# Altium schematic sheet SeccionRF.SchDoc
size A4
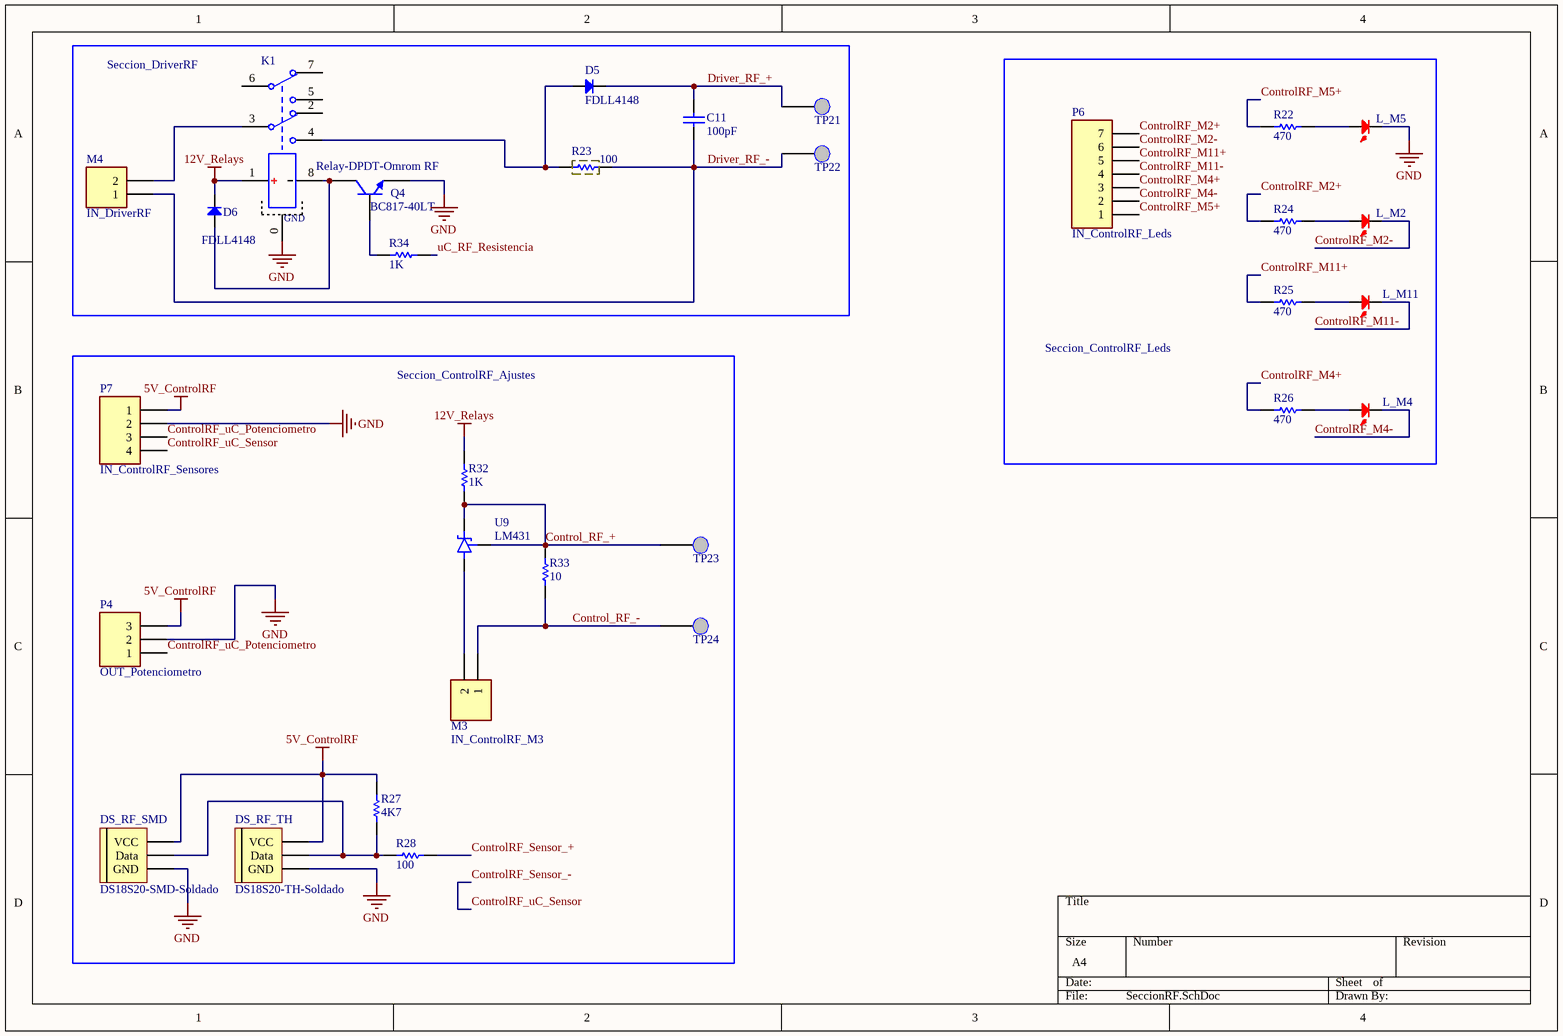
[diagram p0: SeccionRF.SchDoc]

## Parts
C11  100pF  [C_0805]
D5  FDLL4148  [SOD-80/MLL34]
D6  FDLL4148  [SOD-80/MLL34]
DS_RF_SMD  DS18S20-SMD-Soldado  [SOIC8]
DS_RF_TH  DS18S20-TH-Soldado  [TO92]
K1  Relay-DPDT-Omrom RF  [Relay RF omron]
L_M2  PinesParaLed  [Jumper-Simple]  (value not drawn)
L_M4  PinesParaLed  [Jumper-Simple]  (value not drawn)
L_M5  PinesParaLed  [Jumper-Simple]  (value not drawn)
L_M11  PinesParaLed  [Jumper-Simple]  (value not drawn)
M3  IN_ControlRF_M3  [B2B-XH-A_3D]
M4  IN_DriverRF  [B2B-XH-A_3D]
P4  OUT_Potenciometro  [B3B-XH-A_3D]
P6  IN_ControlRF_Leds  [B7B-XH-A_3D]
P7  IN_ControlRF_Sensores  [B4B-XH-A_3D]
Q4  BC817-40LT  [SOT23]
R22  470  [R_0805]
R23  100  [R 10W]
R24  470  [R_0805]
R25  470  [R_0805]
R26  470  [R_0805]
R27  4K7  [R_0805]
R28  100  [R_0805]
R32  1K  [R_0805]
R33  10  [R_0805]
R34  1K  [R_0805]
TP21  DRF+  [TP-5002]  (value not drawn)
TP22  DRF-  [TP-5002]  (value not drawn)
TP23  CRF+  [TP-5002]  (value not drawn)
TP24  CRF-  [TP-5002]  (value not drawn)
U9  LM431  [SOT89]

## Blocks framed on the sheet
Seccion_DriverRF: C11 D5 D6 K1 M4 Q4 R23 R34 TP21 TP22
Seccion_ControlRF_Leds: L_M2 L_M4 L_M5 L_M11 P6 R22 R24-R26
Seccion_ControlRF_Ajustes: DS_RF_SMD DS_RF_TH M3 P4 P7 R27 R28 R32 R33 TP23 TP24 U9

## Nets
5V_ControlRF: DS_RF_SMD.3(VCC) DS_RF_TH.3(VCC) P4.3 P7.1 R27.2
12V_Relays: D6.2(K) K1.1(+) R32.2
GND: DS_RF_SMD.5(GND) DS_RF_TH.1(GND) K1.0(GND) L_M5.2 P4.2 P7.2 Q4.2(E)
Control_RF_+: R32.1 R33.2 TP23.1 U9.1(R) U9.3(K)
Control_RF_-: M3.1 R33.1 TP24.1
ControlRF_M2+: P6.7 R24.1
ControlRF_M2-: L_M2.2 P6.6
ControlRF_M4+: P6.3 R26.1
ControlRF_M4-: L_M4.2 P6.2
ControlRF_M5+: P6.1 R22.1
ControlRF_M11+: P6.5 R25.1
ControlRF_M11-: L_M11.2 P6.4
ControlRF_Sensor_+: R28.2
ControlRF_Sensor_-: P7.4  [also labelled ControlRF_uC_Sensor]
ControlRF_uC_Potenciometro: P4.1 P7.3
Driver_RF_+: C11.2 D5.2(K) TP21.1
Driver_RF_-: C11.1 M4.1 R23.2 TP22.1
uC_RF_Resistencia: R34.1
NetD5_1: D5.1(A) K1.4(NOa) R23.1
NetD6_1: D6.1(A) K1.8(-) Q4.3(C)
NetDS_RF_SMD_4: DS_RF_SMD.4(Data) DS_RF_TH.2(Data) R27.1 R28.1
NetK1_3: K1.3(Ca) M4.2
NetL_M2_1: L_M2.1 R24.2
NetL_M4_1: L_M4.1 R26.2
NetL_M5_1: L_M5.1 R22.2
NetL_M11_1: L_M11.1 R25.2
NetM3_2: M3.2 U9.2(A)
NetQ4_1: Q4.1(B) R34.2

Not connected (* = marked no-connect by the designer): K1 2(NCa) 5(NOb) 6(Cb) 7(NCb)

## Library data of the parts
C11 = C_100pF: CAP CER 100PF 50V C0G/NP0 0805; Note: Footprint corresponds to dimensions for bulk cassette packaging. This case size has tightened tolerances.; Cod.Fabricante: C0805C101J5GACTU; Fabricante: KEMET; Published: 17-Jul-2002; LatestRevisionDate: 19-Mar-2004; LatestRevisionNote: Silkscreen size reduced.; DatasheetDocument: Mar-2001; PackageDocument: Mar-2001; PackageReference: 0805; Publisher: Altium Limited; ComponentLink1Description: Manufacturer Link; ComponentLink1URL: http://www.kemet.com/; ComponentLink2Description: Datasheet; Cod.Digikey: 399-1122-1-ND; Value: 100pF; DIGIKEYx100: 0.02980
D5 D6 = Diode FDLL4148: DIODE GEN PURP 100V 200MA LL34/SOD80/MINI MELF; Fabricante: ON Semiconductor; Published: 8-Jun-2000; LatestRevisionDate: 17-Jul-2002; LatestRevisionNote: Re-released for DXP Platform.; DatasheetDocument: 1998; PackageDocument: Aug-1999; PackageReference: MINI MELF; Publisher: Altium Limited; Code_JEDEC: MINI MELF; ComponentLink1Description: Manufacturer Link; ComponentLink1URL: https://www.fairchildsemi.com; ComponentLink2Description: Datasheet; ComponentLink2URL: https://www.fairchildsemi.com/datasheets/FD/FDLL4148.pdf; Value: FDLL4148; Cod.Digikey: FDLL4148CT-ND; Cod.Fabricante: FDLL4148; DIGIKEYx100: 0.0487
DS_RF_SMD = DS18S20-SMD-Soldado: SENSOR DIGITAL -55C-125C 8SOIC; Cod.Fabricante: DS18S20Z+; Fabricante: Maxim Integrated; Cod.DigiKey: DS18S20Z+-ND; ComponentLink1Description: Manufacturer Link; ComponentLink1URL: https://datasheets.maximintegrated.com/en/ds/DS18S20.pdf; ComponentLink2Description: Datasheet; ComponentLink2URL: *; DatasheetVersion: *; DIGIKEYx10: 3.62160; LatestRevisionDate: *; LatestRevisionNote: *; PackageDescription: *; PackageReference: 8-SOIC; PackageVersion: *; Published: 29-sep-00; Publisher: Altium Limited; Value: DS18S20
DS_RF_TH = DS18S20-TH-Soldado: Temperature Sensor Digital, Local -55°C ~ 125°C 8 b TO-92-3; Cod.Fabricante: DS18S20+; Fabricante: Maxim Integrated; Cod.DigiKey: DS18S20+-ND; ComponentLink1Description: Manufacturer Link; ComponentLink1URL: https://datasheets.maximintegrated.com/en/ds/DS18S20.pdf; ComponentLink2Description: Datasheet; ComponentLink2URL: *; DatasheetVersion: *; DIGIKEYx10: 2.96300; LatestRevisionDate: *; LatestRevisionNote: *; PackageDescription: *; PackageReference: TO92; PackageVersion: *; Published: 29-sep-00; Publisher: Altium Limited; Value: DS18S20
K1 = Relay-DPDT-Omrom RF: RELAY RF DPDT 1A 12V; Fabricante: Omron Electronics Inc-EMC Div; Cod.Fabricante: G6K-2F-RF-S DC12; Value: G6K-2F-RF-S DC12; Published: 24-Mar-1999; LatestRevisionDate: 17-Jul-2002; LatestRevisionNote: Re-released for DXP Platform.; PackageReference: DIP-P8; Publisher: Altium Limited; PackageDescription: Relay; 8 Leads; Cod.Digikey: Z2831-ND; DIGIKEYx100: 12.6118
L_M2 L_M4 L_M5 L_M11 = PinesParaLed: CONN HEADER 2 POS 2.54; Cod.Fabricante: 61300211121; Fabricante: Wurth Electronics Inc.; Cod.DigiKey: 732-5315-ND; ComponentLink1Description: Manufacturer Link; ComponentLink1URL: https://katalog.we-online.de/em/datasheet/6130xx11121.pdf; ComponentLink2Description: Datasheet; ComponentLink2URL: *; DatasheetVersion: *; DIGIKEYx100: 0.06700; LatestRevisionDate: *; LatestRevisionNote: *; PackageDescription: *; PackageReference: *; PackageVersion: *; Published: 29-sep-00; Publisher: Altium Limited; Value: *
M3 M4 = JST_2.5_2: CONN HEADER XH TOP 2POS 2.5MM; Cod.Fabricante: B2B-XH-A(LF)(SN); Fabricante: JST Sales America Inc.; LatestRevisionDate: 17-Jul-2002; LatestRevisionNote: Re-released for DXP Platform.; Publisher: Altium Limited; Cod.Digikey: 455-2247-ND; DIGIKEYx100: 0.0868; ComponentLink2URL: http://www.jst-mfg.com/product/pdf/eng/eXH.pdf; ComponentLink2Description: Datasheet
P4 = JST_2.5_3: CONN HEADER XH TOP 3POS 2.5MM; Cod.Fabricante: B3B-XH-A(LF)(SN); Fabricante: JST Sales America Inc.; LatestRevisionDate: 17-Jul-2002; LatestRevisionNote: Re-released for DXP Platform.; Publisher: Altium Limited; Cod.Digikey: 455-2248-ND; ComponentLink2Description: Datasheet; ComponentLink2URL: http://www.jst-mfg.com/product/pdf/eng/eXH.pdf; DIGIKEYx100: 0.1115
P6 = JST_2.5_7: CONN HEADER XH TOP 7POS 2.5MM; Cod.Fabricante: B7B-XH-A(LF)(SN); Fabricante: JST Sales America Inc.; LatestRevisionDate: 17-Jul-2002; LatestRevisionNote: Re-released for DXP Platform.; Publisher: Altium Limited; Cod.Digikey: 455-2252-ND; ComponentLink2Description: Datasheet; ComponentLink2URL: http://www.jst-mfg.com/product/pdf/eng/eXH.pdf; DIGIKEYx100: 0.2156
P7 = JST_2.5_4: CONN HEADER XH TOP 4POS 2.5MM; Cod.Fabricante: B4B-XH-A(LF)(SN); Fabricante: JST Sales America Inc.; LatestRevisionDate: 17-Jul-2002; LatestRevisionNote: Re-released for DXP Platform.; Publisher: Altium Limited; Cod.Digikey: 455-2249-ND; ComponentLink2Description: Datasheet; ComponentLink2URL: http://www.jst-mfg.com/product/pdf/eng/eXH.pdf; DIGIKEYx100: 0.1348
Q4 = BC817: TRANS NPN 45V 0.5A SOT23; Cod.Fabricante: BC817-40LT1G; Fabricante: ON Semiconductor; Published: 8-Jun-2000; LatestRevisionDate: 15-Jan-2003; LatestRevisionNote: PCB Footprint 'BCY-W3/D4.7' replaced; DatasheetVersion: 1997; PackageVersion: Sep-1998; PackageReference: SOT-23-3; Publisher: Altium Limited; PackageDescription: TO, Flat Index; 3 In-Line, Axial Leads; Body Dia. 4.5mm; Leads 0.51 x 0.48 mm (max); ComponentLink1Description: Manufacturer Link; ComponentLink1URL: http://www.onsemi.com/; ComponentLink2Description: Datasheet; ComponentLink2URL: http://www.onsemi.com/pub/Collateral/BC817-16LT1-D.PDF; Value: BC817-40LT; Cod.Digikey: BC817-40LT1GOSCT-ND; DIGIKEYx100: 0.08810
R22 R24-R26 = R_470: RES SMD 470 OHM 1% 1/8W 0805; Cod.Fabricante: RC0805FR-07470RL; Fabricante: Yageo; Published: 8-Jun-2000; LatestRevisionDate: 17-Jul-2002; LatestRevisionNote: Re-released for DXP Platform.; PackageReference: 0805; Publisher: Altium Limited; Cod.Digikey: 311-470CRCT-ND; Value: 470; DIGIKEYx100: 0.01630
R23 = Resistor-10W: RES 100 OHM 10W 5% AXIAL; Cod.Fabricante: SQP10AJB-100R; Fabricante: Yageo; Published: 8-Jun-2000; LatestRevisionDate: 17-Jul-2002; LatestRevisionNote: Re-released for DXP Platform.; PackageReference: AXIAL; Publisher: Altium Limited; PackageDescription: 0.374" x 0.354" Rectangular x 1.890" L (9.50mm x 9.00mm x 48.00mm); Value: 100; Cod.Digikey: 100W-10-ND; ComponentLink1Description: Datasheet; ComponentLink1URL: https://www.yageo.com/upload/media/product/products/datasheet/lr/Yageo_LR_SQP_NSP_1.pdf; ComponentLink2Description: Packaging specs; ComponentLink2URL: *; DatasheetVersion: *; DIGIKEYx100: 0.49250; PackageVersion: *
R27 = R_4k7: RES SMD 4K7 OHM 1% 1/8W 0805; Cod.Fabricante: RC0805FR-074K7L; Fabricante: Yageo; Published: 8-Jun-2000; LatestRevisionDate: 17-Jul-2002; LatestRevisionNote: Re-released for DXP Platform.; PackageReference: 0805; Publisher: Altium Limited; Cod.Digikey: 311-4.70KCRCT-ND; Value: 4K7; DIGIKEYx100: 0.01630
R28 = R_100: RES SMD 100 OHM 1% 1/8W 0805; Cod.Fabricante: RC0805FR-07100RL; Fabricante: Yageo; Published: 8-Jun-2000; LatestRevisionDate: 17-Jul-2002; LatestRevisionNote: Re-released for DXP Platform.; PackageReference: 0805; Publisher: Altium Limited; Cod.Digikey: 311-100CRCT-ND; Value: 100; DIGIKEYx100: 0.01630
R32 R34 = R_1k: RES SMD 1K OHM 1% 1/8W 0805; Cod.Fabricante: RC0805FR-071KL; Fabricante: Yageo; Published: 8-Jun-2000; LatestRevisionDate: 17-Jul-2002; LatestRevisionNote: Re-released for DXP Platform.; PackageReference: 0805; Publisher: Altium Limited; Cod.Digikey: 311-1.00KCRCT-ND; Value: 1K; DIGIKEYx100: 0.01630
R33 = R_10: RES SMD 10 OHM 1% 1/8W 0805; Cod.Fabricante: RC0805FR-0710RL; Fabricante: Yageo; Published: 8-Jun-2000; LatestRevisionDate: 17-Jul-2002; LatestRevisionNote: Re-released for DXP Platform.; PackageReference: 0805; Publisher: Altium Limited; Cod.Digikey: 311-10.0CRCT-ND; Value: 10; DIGIKEYx100: 0.02770
TP21-TP24 = TestPoint: White PC Test Point, Miniature Phosphor Bronze, Silver Plating 0.040" (1.02mm) Hole Diameter Mounting Type; Cod.Fabricante: 5002; Fabricante: Keystone Electronics; Cod.DigiKey: 36-5002-ND; ComponentLink1Description: Manufacturer Link; ComponentLink1URL: http://www.keyelco.com/product-pdf.cfm?p=1311; ComponentLink2Description: Datasheet; ComponentLink2URL: *; DatasheetVersion: *; DIGIKEYx100: 0.22090; LatestRevisionDate: *; LatestRevisionNote: *; PackageDescription: *; PackageReference: *; PackageVersion: *; Published: 29-sep-00; Publisher: Altium Limited; Value: *
U9 = LM431: IC VREF SHUNT 36V 1% SOT89-3; Cod.Fabricante: LM431SBCMLX; Fabricante: ON Semiconductor; Cod.DigiKey: LM431SBCMLXCT-ND; ComponentLink1Description: Manufacturer Link; ComponentLink1URL: https://www.onsemi.com/pub/Collateral/LM431SA-D.PDF; ComponentLink2Description: Datasheet; ComponentLink2URL: *; DatasheetVersion: *; DIGIKEYx100: 0.25920; LatestRevisionDate: *; LatestRevisionNote: *; PackageDescription: SOT-89-3; PackageReference: SOT-89-3; PackageVersion: *; Published: 29-sep-00; Publisher: Altium Limited; Value: LM431